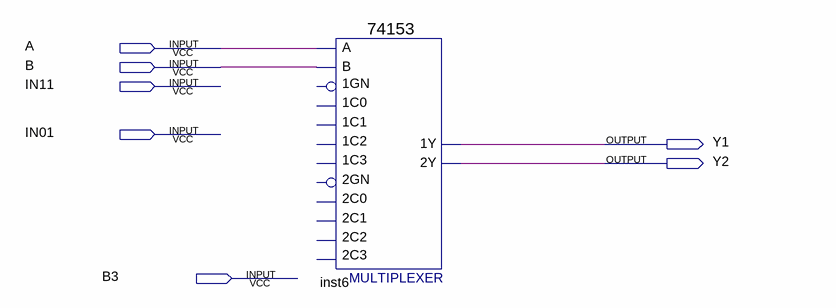
[diagram p0: schematic sheet]
// Quartus schematic test_clock.bdf as structural Verilog: 1 symbols, 7 pins
module test_clock (
  input  A,
  input  B,
  input  IN11,
  input  IN01,
  input  B3,
  output Y1,
  output Y2
);

  \74153  inst6 (.B(B), .A(A), .\1Y (Y1), .\2Y (Y2));  // open: 1C1, 1GN, 1C0, 2C0, 2GN, 2C2, 1C2, 1C3, 2C1, 2C3
endmodule
